# EAGLE design Main (EAGLE 8.5.0)
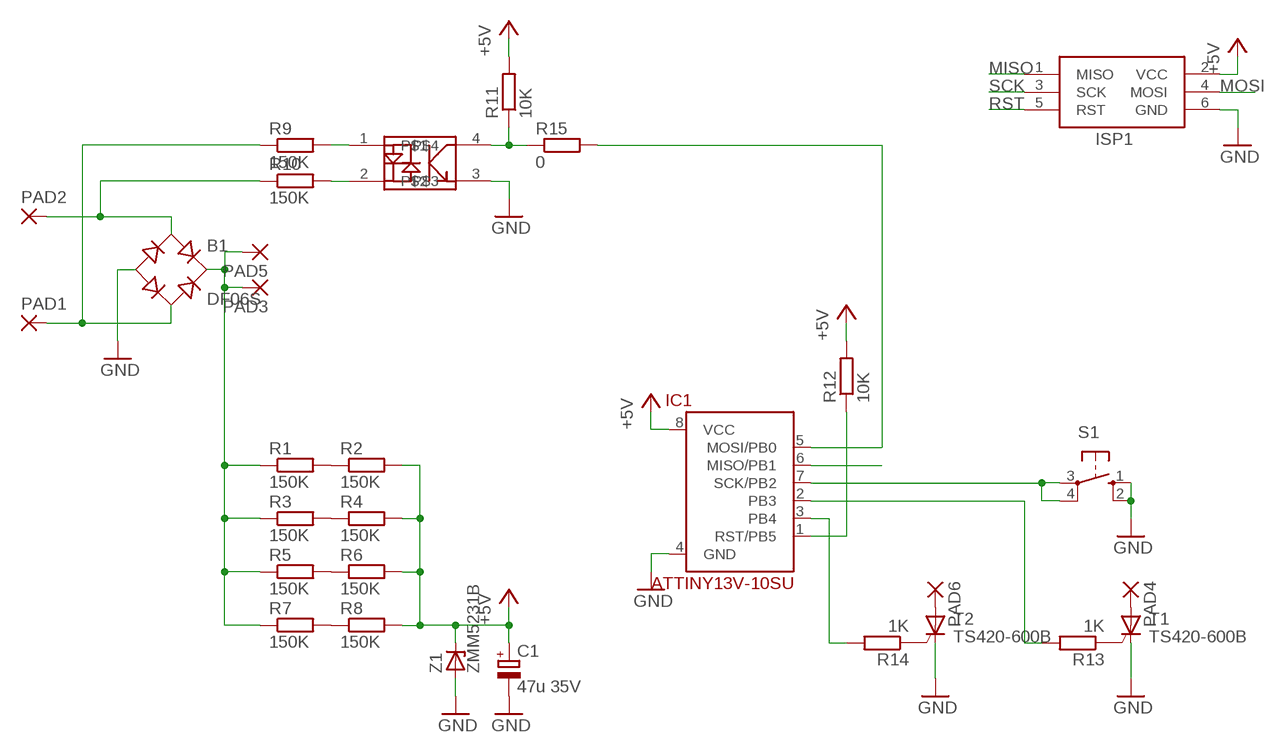
[diagram p0: schematic, sheet 1]

## Parts
B1  DF06S  [DFS]
C1  47u 35V  CPOL-EUCT7343  [CT7343]
IC1  ATTINY13V-10SU  [SOIC8]
ISP1  AVRISP-6  [AVRISP]
PAD1  SMD5  [SMD2,54-5,08]
PAD2  SMD5  [SMD2,54-5,08]
PAD3  SMD5  [SMD2,54-5,08]
PAD4  SMD5  [SMD2,54-5,08]
PAD5  SMD5  [SMD2,54-5,08]
PAD6  SMD5  [SMD2,54-5,08]
R1  150K  R_1206  [R1206]
R2  150K  R_1206  [R1206]
R3  150K  R_1206  [R1206]
R4  150K  R_1206  [R1206]
R5  150K  R_1206  [R1206]
R6  150K  R_1206  [R1206]
R7  150K  R_1206  [R1206]
R8  150K  R_1206  [R1206]
R9  150K  R_1206  [R1206]
R10  150K  R_1206  [R1206]
R11  10K  R_1206  [R1206]
R12  10K  R_1206  [R1206]
R13  1K  R_1206  [R1206]
R14  1K  R_1206  [R1206]
R15  0  R_0805  [R0805]
S1  10-XX  [B3F-10XX]
T1  TS420-600B  THYRISTOR  [DPAK]
T2  TS420-600B  THYRISTOR  [DPAK]
U$1  OPTO-EL3H4(TA)-VG  [SSOP4]
Z1  ZMM5231B  ZENER_MINIMELF  [MINIMELF]

## Nets
+5V: C1.+ IC1.8(VCC) ISP1.2(VCC) R2.2 R4.2 R6.2 R8.2 R11.2 R12.2 Z1.C
GND: B1.- C1.- IC1.4(GND) ISP1.6(GND) S1.1(S) S1.2(S1) T1.G(C) T2.G(C) U$1.3 Z1.A
MISO: IC1.6(MISO/PB1) ISP1.1(MISO)
MOSI: IC1.5(MOSI/PB0) ISP1.4(MOSI) R15.2
N$1: R10.2 U$1.2
N$2: R9.2 U$1.1
N$3: R1.2 R2.1
N$4: R3.2 R4.1
N$5: R5.2 R6.1
N$6: R7.2 R8.1
N$7: B1.+ PAD3.1(P) PAD5.1(P) R1.1 R3.1 R5.1 R7.1
N$8: PAD4.1(P) T1.D(A)
N$9: PAD6.1(P) T2.D(A)
N$10: R13.1 T1.S(G)
N$11: R14.1 T2.S(G)
N$12: B1.AC2 PAD1.1(P) R9.1
N$13: B1.AC1 PAD2.1(P) R10.1
N$14: IC1.3(PB4) R14.2
N$15: IC1.2(PB3) R13.2
N$16: R11.1 R15.1 U$1.4
RST: IC1.1(RST/PB5) ISP1.5(RST) R12.1
SCK: IC1.7(SCK/PB2) ISP1.3(SCK) S1.3(P) S1.4(P1)

## Library data of the parts
B1 = rectifier:DF*S: Surface Mount Glass Passivated Bridge Rectifiers Source: Source: Comchip Bridge Rectifiers DF005S-G thru DF10S-G.pdf
C1 = rcl:CPOL-EU: POLARIZED CAPACITOR, European symbol; SPICEPREFIX: C
IC1 = attiny13:ATTINY13V-10*
ISP1 = adafruit:AVRISP: AVR ISP HEADER Standard 6 pin header for AVR programming
PAD1-PAD6 = wirepad:SMD5: SMD PAD
R1-R15 = Namenlos:R_
S1 = switch-omron:10-XX: OMRON SWITCH; MPN: B3F-1000; OC_FARNELL: 176432; OC_NEWARK: 36M3542
T1 T2 = Namenlos:THYRISTOR
U$1 = Namenlos:OPTO-EL3H4(TA)-VG
Z1 = Namenlos:ZENER_

## Board
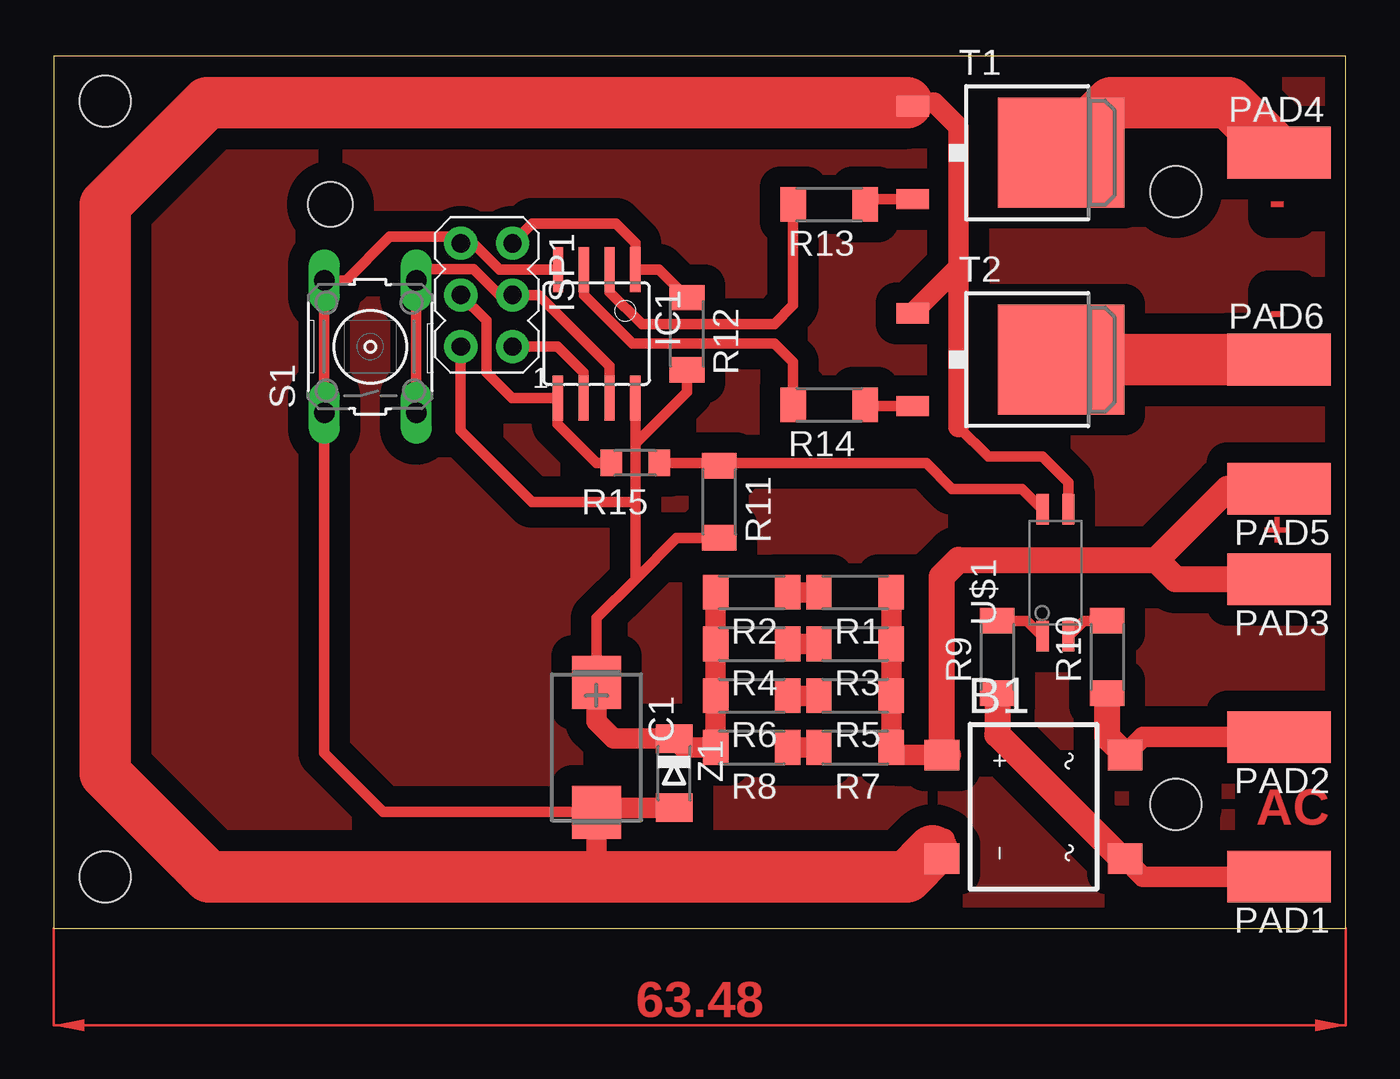
[diagram p1: board, top side]

Size 63.48 x 42.85 mm. Coordinates in mm from the lower left corner, seen from the top.
Outline: 0,0 63.48,0 63.48,42.85 0,42.85 0,0
Copper layers (1*16): Top 0.035mm / dielectric 1.5mm / Bottom 0.035mm
Design rules "default": minimum track width 6mil, minimum drill 0.35mm, track to track 6mil, track to pad 6mil, pad to pad 6mil, via to via 6mil, smd to smd 6mil, copper to edge 40mil, drill to drill 6mil, minimum pad ring 10mil, minimum via ring 8mil, stop-mask expansion 4mil, vias tented up to drill 0mil, thermal gap 10mil
Holes 2.5 mm at 2.54,2.54 2.54,40.64 55.12,6.1 55.12,36.2
Holes 2.2 mm at 13.6,35.56

### Footprints (pad centres in the part's own frame; a part is rotated, then mirrored left to right if it is on the bottom)
DFS = smd 1.5 x 1.7: + -2.55,-4.5; - 2.55,-4.5; AC1 -2.55,4.5; AC2 2.55,4.5
CT7343 = smd 2.6 x 2.4: + -3.2,0; - 3.2,0
SOIC8 = smd 0.5 x 2.2: 1 -1.905,-3.154; 2 -0.645,-3.154; 3 0.625,-3.154; 4 1.895,-3.154; 5 1.905,3.154; 6 0.635,3.154; 7 -0.635,3.154; 8 -1.905,3.154
AVRISP = drill 0.9 pad 1.626: 1 -1.27,2.54; 2 1.27,2.54; 3 -1.27,0; 4 1.27,0; 5 -1.27,-2.54; 6 1.27,-2.54
SMD2,54-5,08 = smd 2.54 x 5.08: 1 0,0
R1206 = smd 1.25 x 1.7: 1 -1.775,0; 2 1.775,0
R0805 = smd 1.05 x 1.3: 1 -1.175,0; 2 1.175,0
B3F-10XX = drill 1.016 long: 1 -3.251,2.261; 2 3.251,2.261; 3 -3.251,-2.261; 4 3.251,-2.261
DPAK = smd 5.4 x 6.2: D 0,2.5 | smd 1 x 1.6: G -2.28,-4.8; S 2.28,-4.8
SSOP4 = smd 0.6 x 1.5: 1 -0.635,-3.115; 2 0.635,-3.115; 3 0.635,3.115; 4 -0.635,3.115
MINIMELF = smd 1.4 x 1.8: A 1.7,0; C -1.7,0

### Placement (x,y rotation side)
B1  48.13,5.97 270 top
C1  26.67,8.89 270 top
IC1  26.67,29.21 180 top
ISP1  21.27,31.11 180 top
PAD1  60.2,2.54 90 top
PAD2  60.2,9.4 90 top
PAD3  60.2,17.14 90 top
PAD4  60.2,38.1 270 top
PAD5  60.2,21.59 90 top
PAD6  60.2,27.94 270 top
R1  39.37,16.51 180 top
R2  34.29,16.51 180 top
R3  39.37,13.97 180 top
R4  34.29,13.97 180 top
R5  39.37,11.43 180 top
R6  34.29,11.43 180 top
R7  39.37,8.89 180 top
R8  34.29,8.89 180 top
R9  46.35,13.34 90 top
R10  51.75,13.34 90 top
R11  32.7,20.95 270 top
R12  31.11,29.21 270 top
R13  38.1,35.56 180 top
R14  38.1,25.72 180 top
R15  28.57,22.86 180 top
S1  15.56,28.57 90 top
T1  46.99,38.1 270 top
T2  46.99,27.94 270 top
U$1  49.21,17.46 0 top
Z1  30.48,7.62 270 top

### Tracks (layer width: path | path; a pad name or v marks a point on that pad's centre or on a via)
+5V
  Top 0.508: 28.57,17.14 26.67,15.24 C1.+ | IC1.8 28.57,23.81 | 28.57,23.81 28.57,20.95 | 28.57,20.95 28.57,17.14 | R12.2 31.11,26.35 28.57,23.81 | ISP1.2 20,24.45 23.5,20.95 28.57,20.95 | R11.2 30.61,19.18 28.57,17.14
  Top 1.016: R2.2 R4.2 R6.2 R8.2 30.91,8.89 Z1.C 27.51,9.32 26.67,10.16 C1.+
GND
  Top 0.508: IC1.4 21.91,32.36 20.62,33.66 ISP1.6 19.68,33.97 16.51,33.97 14.36,31.83 S1.2 S1.1 13.3,8.61 16.19,5.71 26.33,5.71 26.35,5.69 C1.- | U$1.3 49.85,21.91 48.58,23.18 45.91,23.18 44.45,24.64
  Top 1.016: B1.- 43.76,4.39 43.18,3.81 | T2.G 44.45,32.48 | 40.56,40.56 40.64,40.56 43.26,40.56 44.45,39.37 44.45,32.48 | T1.G 42.01,40.56 41.91,40.56 | 26.67,2.54 C1.- 26.9,5.92 Z1.A | 44.45,24.64 44.45,32.48
  Top 2.54: 43.18,3.81 41.91,2.54 26.67,2.54 7.62,2.54 2.54,7.62 2.54,35.56 7.54,40.56 40.64,40.56 41.91,40.56
MISO
  Top 0.508: IC1.6 26.04,27.3 24.77,28.57 ISP1.1
MOSI
  Top 0.508: R15.2 26.67,22.86 24.77,24.77 IC1.5 22.52,26.06 21.27,27.3 21.27,29.84 ISP1.4
N$1
  Top 0.508: U$1.2 50.61,15.11 R10.2
N$2
  Top 0.508: U$1.1 47.81,15.11 R9.2
N$3
  Top 1.016: R1.2 R2.1
N$4
  Top 1.016: R3.2 R4.1
N$5
  Top 1.016: R5.2 R6.1
N$6
  Top 1.016: R7.2 R8.1
N$7
  Top 1.016: 41.16,11.43 R5.1 | R5.1 R3.1 R1.1 | 44.08,8.52 B1.+ 41.52,8.52 R7.1 R5.1
  Top 1.27: B1.+ 43.63,17.28 44.45,18.1 54.17,18.1 | 54.17,18.1 57.66,21.59 PAD5.1 | PAD3.1 55.12,17.14 54.17,18.1
N$8
  Top 2.54: PAD4.1 57.73,40.56 51.95,40.56 T1.D
N$9
  Top 2.54: T2.D PAD6.1
N$10
  Top 0.508: R13.1 40.13,35.82 T1.S
N$11
  Top 0.508: R14.1 39.93,25.66 T2.S
N$12
  Top 0.508: 52.46,3.42 B1.AC2
  Top 1.016: B1.AC2 53.51,2.54 PAD1.1 61.47,2.54
  Top 1.27: R9.1 46.35,9.53 52.46,3.42
N$13
  Top 1.016: B1.AC1 53.51,9.4 PAD2.1
  Top 1.27: B1.AC1 51.75,9.4 R10.1
N$14
  Top 0.508: IC1.3 26.05,31.11 28.43,28.73 35.4,28.73 36.33,27.81 R14.2
N$15
  Top 0.508: R13.2 36.33,30.61 35.4,29.69 28.89,29.69 27.32,31.26 IC1.2
N$16
  Top 0.508: R15.1 32.26,22.86 32.7,22.86 | U$1.4 47.56,21.59 44.13,21.59 42.86,22.86 32.7,22.86 | R11.1 32.7,22.86
N$17
  pour Top (isolate 1.016): 0,0 63.18,0 63.18,42.55 0,42.55
RST
  Top 0.508: R12.1 29.74,32.36 IC1.1 28.57,33.66 27.62,34.61 23.5,34.61 ISP1.5
SCK
  Top 0.508: IC1.7 27.3,27.62 23.81,31.11 ISP1.3 21.91,31.11 20.64,32.38 18.38,32.38 S1.4 S1.3
(copper drawn outside any net)
  shapes: Top area x1

### Text on the board
Top: - | - | + | AC